# Altium project RaspberryPi_ComputeModule3.PrjPCB (part 1 of 2)
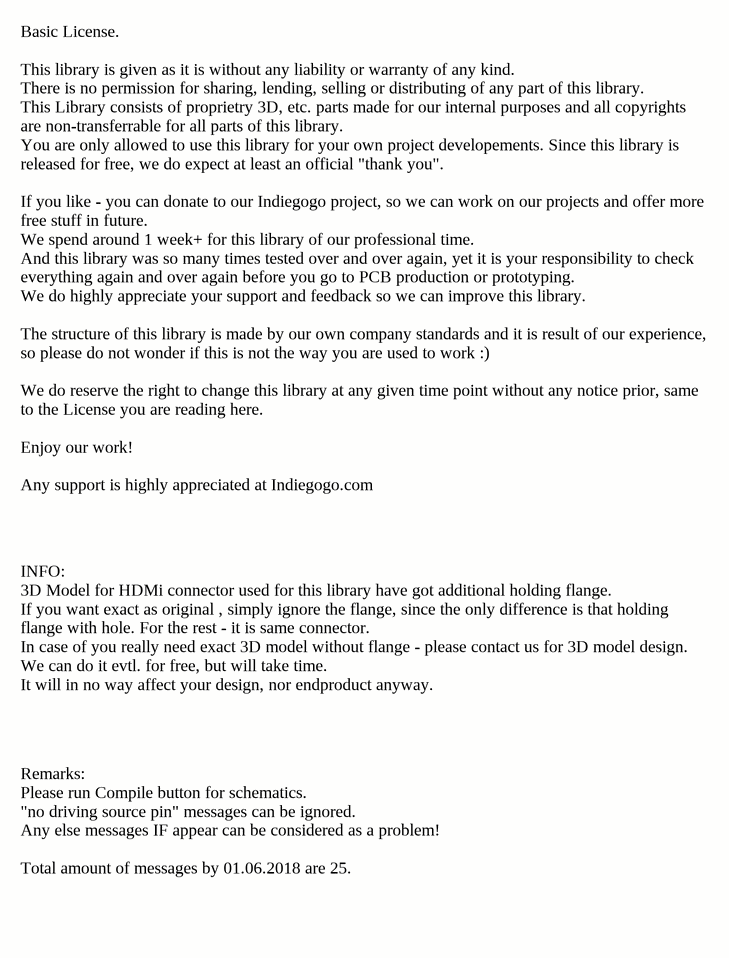
[diagram p0: ReadMe_License.SchDoc]
10 sheets, 86 parts. Net scope: global (net labels, ports and power ports of the same name join across sheets).
Board file: RaspberryPi_ComputeModule3.PcbDoc
Sheets:
  ReadMe_License.SchDoc
  RP_ComputeModule3_rev.3.0_GPIOs.SchDoc
  RP_ComputeModule3_rev.3.0_POWER.SchDoc
  RP_ComputeModule3_rev.3.0_uSDCard.SchDoc
  RP_ComputeModule3_rev.3.0_Headers.SchDoc
  RP_ComputeModule3_rev.3.0_BootSelector.SchDoc
  RP_ComputeModule3_rev.3.0_Displays.SchDoc
  RP_ComputeModule3_rev.3.0_Mechanics.SchDoc
  RP_ComputeModule3_rev.3.0_USB.SchDoc
  RP_ComputeModule3_rev.3.0_HDMi.SchDoc

## Sheet ReadMe_License.SchDoc
size E

### Notes on the sheet
- Basic License.
  This library is given as it is without any liability or warranty of any kind.
  There is no permission for sharing, lending, selling or distributing of any part of this library.
  This Library consists of proprietry 3D, etc. parts made for our internal purposes and all copyrights are non-transferrable for all parts of this library.
  You are only allowed to use this library for your own project developements. Since this library is released for free, we do expect at least an official "thank you".
  If you like - you can donate to our Indiegogo project, so we can work on our projects and offer more free stuff in future.
  We spend around 1 week+ for this library of our professional time.
  And this library was so many times tested over and over again, yet it is your responsibility to check everything again and over again before you go to PCB production or prototyping.
  We do highly appreciate your support and feedback so we can improve this library.
  The structure of this library is made by our own company standards and it is result of our experience, so please do not wonder if this is not the way you are used to work :)
  We do reserve the right to change this library at any given time point without any notice prior, same to the License you are reading here.
  Enjoy our work!
  Any support is highly appreciated at Indiegogo.com
- INFO:
  3D Model for HDMi connector used for this library have got additional holding flange.
  If you want exact as original , simply ignore the flange, since the only difference is that holding flange with hole. For the rest - it is same connector.
  In case of you really need exact 3D model without flange - please contact us for 3D model design.
  We can do it evtl. for free, but will take time.
  It will in no way affect your design, nor endproduct anyway.
- Remarks:
  Please run Compile button for schematics.
  "no driving source pin" messages can be ignored.
  Any else messages IF appear can be considered as a problem!
  Total amount of messages by 01.06.2018 are 25.

## Sheet RP_ComputeModule3_rev.3.0_GPIOs.SchDoc
size A4
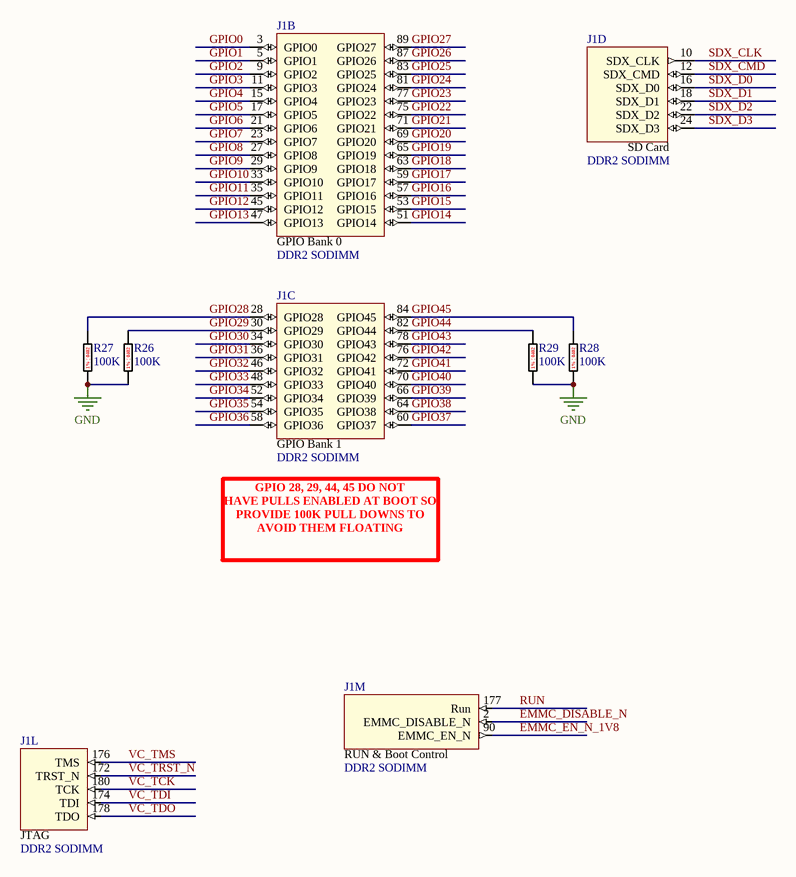
[diagram p1: RP_ComputeModule3_rev.3.0_GPIOs.SchDoc]

### Parts
J1  DDR2 SODIMM  [TE 1473005-4 (DDR2 SO-DIMM)]  (parts B,C,D,L,M of 14)
R26  100K  [RES0402]
R27  100K  [RES0402]
R28  100K  [RES0402]
R29  100K  [RES0402]

### Nets
GND: R26.2 R27.2 R28.2 R29.2
EMMC_DISABLE_N: J1.2(EMMC_DISABLE_N)
EMMC_EN_N_1V8: J1.90(EMMC_EN_N)
GPIO0: J1.3(GPIO0)
GPIO1: J1.5(GPIO1)
GPIO2: J1.9(GPIO2)
GPIO3: J1.11(GPIO3)
GPIO4: J1.15(GPIO4)
GPIO5: J1.17(GPIO5)
GPIO6: J1.21(GPIO6)
GPIO7: J1.23(GPIO7)
GPIO8: J1.27(GPIO8)
GPIO9: J1.29(GPIO9)
GPIO10: J1.33(GPIO10)
GPIO11: J1.35(GPIO11)
GPIO12: J1.45(GPIO12)
GPIO13: J1.47(GPIO13)
GPIO14: J1.51(GPIO14)
GPIO15: J1.53(GPIO15)
GPIO16: J1.57(GPIO16)
GPIO17: J1.59(GPIO17)
GPIO18: J1.63(GPIO18)
GPIO19: J1.65(GPIO19)
GPIO20: J1.69(GPIO20)
GPIO21: J1.71(GPIO21)
GPIO22: J1.75(GPIO22)
GPIO23: J1.77(GPIO23)
GPIO24: J1.81(GPIO24)
GPIO25: J1.83(GPIO25)
GPIO26: J1.87(GPIO26)
GPIO27: J1.89(GPIO27)
GPIO28: J1.28(GPIO28) R27.1
GPIO29: J1.30(GPIO29) R26.1
GPIO30: J1.34(GPIO30)
GPIO31: J1.36(GPIO31)
GPIO32: J1.46(GPIO32)
GPIO33: J1.48(GPIO33)
GPIO34: J1.52(GPIO34)
GPIO35: J1.54(GPIO35)
GPIO36: J1.58(GPIO36)
GPIO37: J1.60(GPIO37)
GPIO38: J1.64(GPIO38)
GPIO39: J1.66(GPIO39)
GPIO40: J1.70(GPIO40)
GPIO41: J1.72(GPIO41)
GPIO42: J1.76(GPIO42)
GPIO43: J1.78(GPIO43)
GPIO44: J1.82(GPIO44) R29.1
GPIO45: J1.84(GPIO45) R28.1
RUN: J1.177(Run)
SDX_CLK: J1.10(SDX_CLK)
SDX_CMD: J1.12(SDX_CMD)
SDX_D0: J1.16(SDX_D0)
SDX_D1: J1.18(SDX_D1)
SDX_D2: J1.22(SDX_D2)
SDX_D3: J1.24(SDX_D3)
VC_TCK: J1.180(TCK)
VC_TDI: J1.174(TDI)
VC_TDO: J1.178(TDO)
VC_TMS: J1.176(TMS)
VC_TRST_N: J1.172(TRST_N)

### Notes on the sheet
- GPIO 28, 29, 44, 45 DO NOT
  HAVE PULLS ENABLED AT BOOT SO PROVIDE 100K PULL DOWNS TO AVOID THEM FLOATING
- (in symbol 1473005-4, part B) GPIO Bank 0
- (in symbol 1473005-4, part C) GPIO Bank 1
- (in symbol 1473005-4, part D) SD Card
- (in symbol 1473005-4, part L) JTAG
- (in symbol 1473005-4, part M) RUN & Boot Control
- (in symbol SG73P1ETTP1003F) 1% | 0402

### Library data of the parts
J1 = 1473005-4: TE CONNECTIVITY / AMP         1473005-4             SOCKET IC, DIMM, DDR2, 1.8V, 200WAY; Number of Contacts: 200; Memory Type: SDRAM,DDR; Insulation Resistance: 250MR; PCB Mount Retention: With; Gender: Female; Contact Current Rating: 500mA; Circuit Application: Power; Connector System: Cable-to-Board; Sealable: No (Without); Pitch: 0.6mm; Row Spacing: 0.244inch; Stack Height: 5.2mm; Supplier 1: Digi-Key; Manufacturer: TE Connectivity; Manufacturer Part Number: 1473005-4; Stock 1: 3804; Pricing 1: 1=3.9, 10=3.744, 25=3.432, 50=3.276, 100=3.12, 250=2.73, 500=2.652, 1000=2.262, 2500=2.106 (USD); Mount: Surface Mount; Number of Pins: 200; Contact Material: Copper Alloy; Contact Plating: Gold; Housing Colour: Black; Housing Material: Thermoplastic; Insulation Material: Thermoplastic; Min Operating Temperature: -67°C; Max Operating Temperature: 185°C; Number of Rows: 2; Orientation: Right Angle; Termination: Solder; Packaging: Tray; Package Quantity: 20; Number of Positions: 200; Voltage Rating: 1.8V; Connector Type: Socket; Length: 71.5mm; Depth: 26mm; Radiation Hardening: No; ELV: Compliant; Flammability Rating: UL94 V-0; Lead Free: Lead Free; REACH SVHC: No SVHC; ComponentLink1URL: https://datasheet.ciiva.com/682/eng-cd-1473005-j2-682720.pdf; ComponentLink1Description: https://datasheet.ciiva.com/682/eng-cd-1473005-j2-682720.pdf; ComponentLink2URL: https://datasheet.ciiva.com/15171/getdatasheetpartid-99150-15171488.pdf; ComponentLink2Description: https://datasheet.ciiva.com/15171/getdatasheetpartid-99150-15171488.pdf; ComponentLink3URL: https://datasheet.ciiva.com/1105/582309-1105221.pdf; ComponentLink3Description: https://datasheet.ciiva.com/1105/582309-1105221.pdf; ComponentLink4URL: https://datasheet.ciiva.com/682/eng-cd-1473005-j2-682726.pdf; ComponentLink4Description: https://datasheet.ciiva.com/682/eng-cd-1473005-j2-682726.pdf; ComponentLink5URL: https://datasheet.ciiva.com/14156/04821302-14156311.pdf; ComponentLink5Description: https://datasheet.ciiva.com/14156/04821302-14156311.pdf; ComponentLink6URL: https://datasheet.ciiva.com/3136/eng-cd-1473005-j-3136060.pdf; ComponentLink6Description: https://datasheet.ciiva.com/3136/eng-cd-1473005-j-3136060.pdf; ComponentLink7URL: https://datasheet.ciiva.com/16380/eng-cd-1473005-j-16380909.pdf; ComponentLink7Description: https://datasheet.ciiva.com/16380/eng-cd-1473005-j-16380909.pdf; ComponentLink8URL: https://datasheet.ciiva.com/16651/eng-cd-1473005-j-16651646.pdf; ComponentLink8Description: https://datasheet.ciiva.com/16651/eng-cd-1473005-j-16651646.pdf
R26-R29 = SG73P1ETTP1003F: Thick Film Resistors - SMD 0.125W 100Kohm 1% 200ppm; Manufacturer: KOA Speer; Resistance: 100kR; Power Rating: 125mW; Voltage Rating: 200V; Temperature Coefficient: 200ppm/°C; Voltage Rating (DC): 50V; Supplier 1: Mouser; Manufacturer Part Number: SG73P1ETTP1003F; Stock 1: 17094; Pricing 1: 1=0.24, 10=0.24, 50=0.053, 100=0.041, 1000=0.03, 10000=0.018 (USD); Case/Package: 0402; Case Code (Imperial): 0402; Case Code (Metric): 1005; Min Operating Temperature: -55°C; Max Operating Temperature: 155°C; Tolerance: 1%; Packaging: Tape and Reel; Termination: SMD/SMT; ComponentLink1URL: https://datasheet.ciiva.com/5567/sg73-5567782.pdf; ComponentLink1Description: https://datasheet.ciiva.com/5567/sg73-5567782.pdf

## Sheet RP_ComputeModule3_rev.3.0_POWER.SchDoc
size A4 portrait
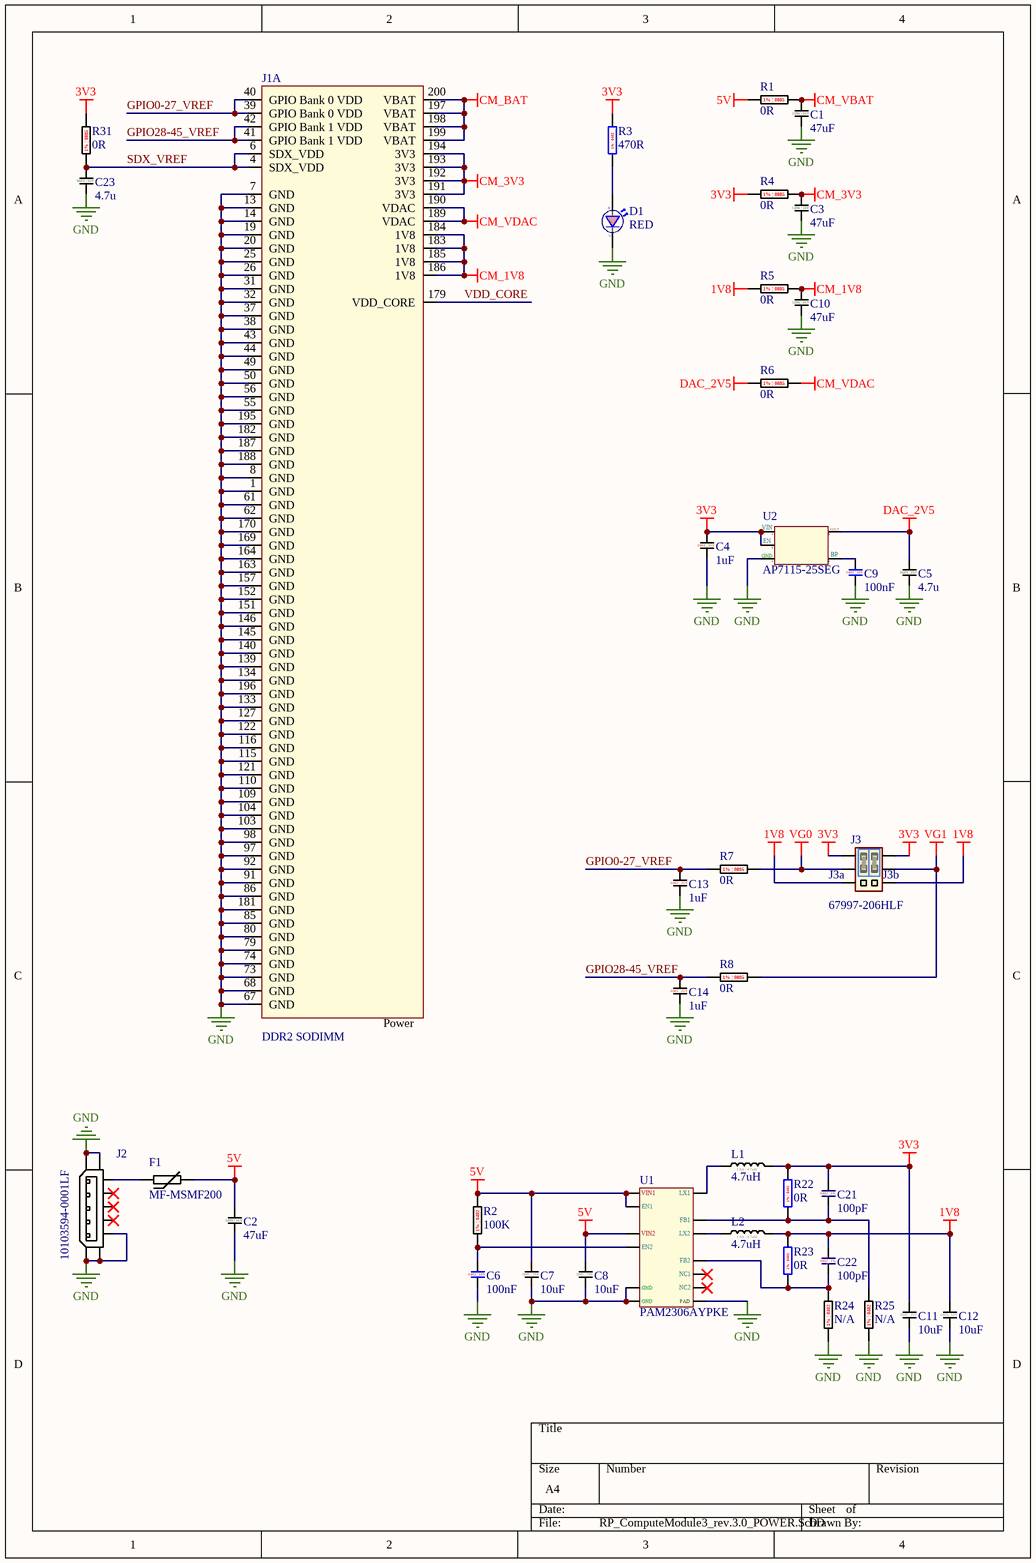
[diagram p2: RP_ComputeModule3_rev.3.0_POWER.SchDoc]

### Parts
C1  47uF  [MURATA C1206 / CAPC3216X94N]
C2  47uF  [MURATA C1206 / CAPC3216X94N]
C3  47uF  [MURATA C1206 / CAPC3216X94N]
C4  1uF  [TDK 0402 C]
C5  4.7u  [0603 Murata]
C6  100nF  [GJM 0402 C]
C7  10uF  [0805 CGA Series]
C8  10uF  [0805 CGA Series]
C9  100nF  [GJM 0402 C]
C10  47uF  [MURATA C1206 / CAPC3216X94N]
C11  10uF  [0805 CGA Series]
C12  10uF  [0805 CGA Series]
C13  1uF  [TDK 0402 C]
C14  1uF  [TDK 0402 C]
C21  100pF  [Cap0402 MIN Vishay N/A]  (no BOM)
C22  100pF  [Cap0402 MIN Vishay N/A]  (no BOM)
C23  4.7u  [0603 Murata]
D1  RED  [ROHM 0603 LED]
F1  MF-MSMF200  [Bourns MF-MSMF (Style1)]
J1  DDR2 SODIMM  [TE 1473005-4 (DDR2 SO-DIMM)]  (part A of 14)
J2  10103594-0001LF  [FCI_10103594-0001LF]
J3  67997-206HLF  [Amphenol 2x6 PINS 67997-206HLF]
J3a  Jumper  [Kobiconn 151-8011-E (Blue)]  (value not drawn)
J3b  Jumper  [Kobiconn 151-8011-E (Blue)]  (value not drawn)
L1  4.7uH  [Bourns SRN4018]
L2  4.7uH  [Bourns SRN4018]
R1  0R  [YAGEO RES0402]
R2  100K  [RES0402]
R3  470R  [Vishay RES0402]
R4  0R  [YAGEO RES0402]
R5  0R  [YAGEO RES0402]
R6  0R  [YAGEO RES0402]
R7  0R  [YAGEO RES0402]
R8  0R  [YAGEO RES0402]
R22  0R  [Vishay Beyschlag MCS0402]
R23  0R  [Vishay Beyschlag MCS0402]
R24  N/A  [RES0402N/A]  (no BOM)
R25  N/A  [RES0402N/A]  (no BOM)
R31  0R  [YAGEO RES0402]
U1  PAM2306AYPKE  [DIODES_SON45P300X300X80-13N]
U2  AP7115-25SEG  [Diodes_SOT353_SC70-5_SOT65P210X110-5N]

### Nets
1V8: C12.1 C22.2 J3.5 J3.6 L2.2 R5.2 R23.1
3V3: C4.1 C11.1 C21.2 J3.1 J3.2 L1.2 R3.1 R4.2 R22.1 R31.1 U2.1 U2.3
5V: C2.2 C7.1 C8.1 F1.2 R1.2 R2.1 U1.1 U1.6 U1.7
CM_1V8: C10.2 J1.183(1V8) J1.184(1V8) J1.185(1V8) J1.186(1V8) R5.1
CM_3V3: C3.2 J1.191(3V3) J1.192(3V3) J1.193(3V3) J1.194(3V3) R4.1
CM_BAT: J1.197(VBAT) J1.198(VBAT) J1.199(VBAT) J1.200(VBAT)
CM_VBAT: C1.2 R1.1
CM_VDAC: J1.189(VDAC) J1.190(VDAC) R6.1
DAC_2V5: C5.2 R6.2 U2.5
GND: C1.1 C2.1 C3.1 C4.2 C5.1 C6.1 C7.2 C8.2 C9.1 C10.1 C11.2 C12.2 C13.2 C14.2 C23.1 D1.C J1.1(GND) J1.7(GND) J1.8(GND) J1.13(GND) J1.14(GND) J1.19(GND) J1.20(GND) J1.25(GND) J1.26(GND) J1.31(GND) J1.32(GND) J1.37(GND) J1.38(GND) J1.43(GND) J1.44(GND) J1.49(GND) J1.50(GND) J1.55(GND) J1.56(GND) J1.61(GND) J1.62(GND) J1.67(GND) J1.68(GND) J1.73(GND) J1.74(GND) J1.79(GND) J1.80(GND) J1.85(GND) J1.86(GND) J1.91(GND) J1.92(GND) J1.97(GND) J1.98(GND) J1.103(GND) J1.104(GND) J1.109(GND) J1.110(GND) J1.115(GND) J1.116(GND) J1.121(GND) J1.122(GND) J1.127(GND) J1.133(GND) J1.134(GND) J1.139(GND) J1.140(GND) J1.145(GND) J1.146(GND) J1.151(GND) J1.152(GND) J1.157(GND) J1.163(GND) J1.164(GND) J1.169(GND) J1.170(GND) J1.181(GND) J1.182(GND) J1.187(GND) J1.188(GND) J1.195(GND) J1.196(GND) J2.5 J2.6 J2.7 J2.8 J2.9 J2.10 J2.11 R24.2 R25.2 U1.3 U1.9 U1.13 U2.2
VG0: J3.3 R7.1
VG1: J3.4 R8.1
GPIO0-27_VREF: C13.1 J1.39(GPIO_Bank_0_VDD) J1.40(GPIO_Bank_0_VDD) R7.2
GPIO28-45_VREF: C14.1 J1.41(GPIO_Bank_1_VDD) J1.42(GPIO_Bank_1_VDD) R8.2
SDX_VREF: C23.2 J1.4(SDX_VDD) J1.6(SDX_VDD) R31.2
VDD_CORE: J1.179(VDD_CORE)
NetC6_2: C6.2 R2.2 U1.12
NetC9_2: C9.2 U2.4
NetC21_1: C21.1 R22.2 R25.1 U1.4
NetC22_1: C22.1 R23.2 R24.1 U1.10
NetD1_A: D1.A R3.2
NetF1_1: F1.1 J2.1
NetL1_1: L1.1 U1.8
NetL2_1: L2.1 U1.2

Not connected (* = marked no-connect by the designer): J2 2* 3* 4*; U1 5* 11*

### Notes on the sheet
- (in symbol AC0805FR-070RL) 1% | 0805
- (in symbol AP7115-25SEG-7) VIN; VOUT; EN; BP; GND
- (in symbol C1005X5R1E105K050BC) 0402 | 25V
- (in symbol C2012X7S1C106K125AC) 0805 | 16V
- (in symbol C3216JB1C476M160AB) 1206 | 16V
- (in symbol GRM155R71A104JA01D) 0402 | 10V
- (in symbol GRT188R6YA475KE13D) 0603 | 35V
- (in symbol MCS04020C4700FE000) 1% | 0402
- (in symbol MCS04020Z0000ZE000) 1% | 0402
- (in symbol PAM2306AYPKE) VIN1; LX1; EN1; FB1; VIN2; LX2; EN2; FB2; NC1; GND; NC2; PAD
- (in symbol Resistor_N/A) 1% | 0402
- (in symbol SG73P1ETTP1003F) 1% | 0402
- (in symbol SRN4018-4R7M) 1.9A / 4.7uH
- (in symbol VJ0402A101FXACW1BC_NA) 0402 | 1%

### Library data of the parts
C1-C3 C10 = C3216JB1C476M160AB: 47µF ±20% 16V JB Ceramic Capacitor -25°C ~ 85°C Surface Mount, MLCC 1206 (3216 Metric) 0.126" L x 0.063" W (3.20mm x 1.60mm); Manufacturer: TDK; Supplier 1: Digi-Key; Manufacturer Part Number: C3216JB1C476M160AB; Stock 1: 203837; Pricing 1: 1=1.2, 10=0.949, 100=0.7116, 500=0.53762, 1000=0.47438 (USD); Mount: Surface Mount; Case/Package: 1206; Case Code (Metric): 3216; Case Code (Imperial): 1206; Dielectric Material: Ceramic; Min Operating Temperature: -25°C; Max Operating Temperature: 85°C; Package Quantity: 1; Packaging: Tape and Reel; Capacitance: 47uF; Tolerance: 20%; Voltage Rating: 16V; Termination: SMD/SMT; Composition: Ceramic; Voltage Rating (DC): 16V; Length: 0.126inch; Height: 1.6mm; Width: 0.063inch; Thickness: 0.069inch; Lead Free: Lead Free; ComponentLink1URL: https://product.tdk.com/en/products/common/pdf/mlcc_partnumber_description.pdf; ComponentLink1Description: https://product.tdk.com/en/products/common/pdf/mlcc_partnumber_description.pdf; ComponentLink2URL: http://product.tdk.com/en/catalog/datasheets/mlcc_commercial_general_en.pdf; ComponentLink2Description: http://product.tdk.com/en/catalog/datasheets/mlcc_commercial_general_en.pdf; ComponentLink3URL: http://www.mouser.com/ds/2/400/lcc_commercial_general_en-837201.pdf; ComponentLink3Description: http://www.mouser.com/ds/2/400/lcc_commercial_general_en-837201.pdf
C4 C13 C14 = C1005X5R1E105K050BC: Multilayer Ceramic Capacitors MLCC - SMD/SMT 0402 25V 1uF X5R 10% T: 0.5mm; Manufacturer: TDK; Type: Multilayer Ceramic Chip Capacitor; Voltage Rating DC: 25 VDC; Capacitance - nF: 1000 nF; Product Status: Not Recommended for New Designs; Supplier 1: Mouser; Manufacturer Part Number: C1005X5R1E105K050BC; RoHS: RoHS Compliant; Category: Multilayer Ceramic Capacitors MLCC - SMD/SMT; Stock 1: 6906; Pricing 1: 1=0.201, 10=0.136, 100=0.054, 500=0.045, 1000=0.037, 2500=0.031, 10000=0.027 (USD); Capacitance: 1 uF; Height: 0.5 mm; Length: 1 mm; Package / Case: 0402 (1005 metric); Packaging: Cut Tape; Product: General Type MLCCs; Series: C; Termination Style: SMD/SMT; Tolerance: 10 %; Width: 0.5 mm; Brand: TDK; Case Code - in: 0402; Case Code - mm: 1005; Dielectric: X5R; Maximum Operating Temperature: + 85 C; Minimum Operating Temperature: - 55 C; Standard Pack Qty: 10000; RoHS - Mouser: Y; Minimum Order Quantity: 1; Reeling: True; ComponentLink1URL: https://www.mouser.com/ds/2/400/lcc_commercial_general_en-837201.pdf; ComponentLink1Description: https://www.mouser.com/ds/2/400/lcc_commercial_general_en-837201.pdf
C5 C23 = GRT188R6YA475KE13D: 4.7µF 35V Ceramic Capacitor X5R 0603 (1608 Metric) 0.063" L x 0.031" W (1.60mm x 0.80mm); Manufacturer: Murata; Capacitance: 4.7uF; Tolerance: 10%; Supplier 1: Mouser; Manufacturer Part Number: GRT188R6YA475KE13D; Stock 1: 292; Pricing 1: 10000=0.133 (USD); Mount: Surface Mount; Case/Package: 0603; Case Code (Metric): 1608; Case Code (Imperial): 0603; Min Operating Temperature: -55°C; Max Operating Temperature: 85°C; Packaging: Tape and Reel; Voltage Rating: 35V; Length: 0.063inch; Width: 0.031inch; Thickness: 0.035inch; ComponentLink1URL: http://search.murata.co.jp/Ceramy/image/img/A01X/G101/ENG/GRT188R6YA475KE13-01.pdf; ComponentLink1Description: http://search.murata.co.jp/Ceramy/image/img/A01X/G101/ENG/GRT188R6YA475KE13-01.pdf
C6 C9 = GRM155R71A104JA01D: Multilayer Ceramic Capacitors MLCC - SMD/SMT 0402 0.1uF 10volts 5%; Manufacturer: Murata Electronics; Type: Chip Monolithic Ceramic Capacitor; Voltage Rating DC: 10 VDC; Capacitance - pF: 100000 pF; Dielectric: X7R; Supplier 1: Mouser; Manufacturer Part Number: GRM155R71A104JA01D; RoHS: RoHS Compliant; Category: Multilayer Ceramic Capacitors MLCC - SMD/SMT; Stock 1: 376; Pricing 1: 1=0.100, 10=0.024, 100=0.011, 500=0.008, 1000=0.006, 5000=0.005, 10000=0.004 (USD); Capacitance: 0.1 uF; Height: 0.5 mm; Length: 1 mm; Package / Case: 0402 (1005 metric); Packaging: Cut Tape; Product: General Type MLCCs; Series: GRM; Termination Style: SMD/SMT; Tolerance: 5 %; Width: 0.5 mm; Brand: Murata Electronics; Capacitance - nF: 100 nF; Case Code - in: 0402; Case Code - mm: 1005; Maximum Operating Temperature: + 125 C; Minimum Operating Temperature: - 55 C; Standard Pack Qty: 10000; RoHS - Mouser: Y; Minimum Order Quantity: 1; Reeling: True; ComponentLink1URL: https://www.mouser.com/ds/2/281/c02e-2905.pdf; ComponentLink1Description: https://www.mouser.com/ds/2/281/c02e-2905.pdf
C7 C8 C11 C12 = C2012X7S1C106K125AC: Manufacturer: TDK; Supplier 1: Mouser; Manufacturer Part Number: C2012X7S1C106K125AC; Stock 1: 5410; Pricing 1: 1=0.7, 10=0.4, 50=0.4, 100=0.27, 1000=0.226, 10000=0.138 (USD)
C21 C22 = VJ0402A101FXACW1BC_NA: Multilayer Ceramic Capacitors MLCC - SMD/SMT 0402 100pF 50volts C0G 1%; Manufacturer: Vishay Vitramon; Dielectric Material: Tantalum; Voltage Rating (DC): 50V; Supplier 1: Mouser; Manufacturer Part Number: VJ0402A101FXACW1BC; Stock 1: 4478; Pricing 1: 10000=0.026 (USD); Mount: Surface Mount; Case/Package: 0402; Case Code (Imperial): 0402; Case Code (Metric): 1005; Min Operating Temperature: -55°C; Max Operating Temperature: 125°C; Capacitance: 100pF; Tolerance: 1%; Packaging: Tape and Reel; Package Quantity: 10000; Dielectric: C0G; Termination: SMD/SMT; Length: 1mm; Height: 0.55mm; Width: 0.5mm; Depth: 0.5mm; Lead Free: Lead Free; ComponentLink1URL: https://datasheet.ciiva.com/11477/vjw1bcbascomseries-11477228.pdf; ComponentLink1Description: https://datasheet.ciiva.com/11477/vjw1bcbascomseries-11477228.pdf
D1 = SML-D12U8WT86: LED RED DIFFUSED 0603 SMD; Manufacturer: Rohm; Lens Colour: White,Clear,Diffused; Lens Style: Diffused,Colorless,Rectangular; Forward Voltage: 2.2V; Forward Current: 20mA; Luminous Intensity: 63mcd; Dominant Wavelength: 620nm; Number of LEDs: 1; Viewing Angle: 160°; Supplier 1: Mouser; Manufacturer Part Number: SML-D12U8WT86; Stock 1: 16573; Pricing 1: 1=0.32, 10=0.216, 50=0.216, 100=0.09, 1000=0.062, 10000=0.041 (USD); Mount: Surface Mount; Case/Package: 0603; Number of Pins: 2; Colour: Red; Case Code (Metric): 1608; Case Code (Imperial): 0603; Min Operating Temperature: -40°C; Max Operating Temperature: 85°C; Packaging: Tape and Reel; Wavelength: 620nm; Package Quantity: 1; Illumination Colour: Red; Test Current: 20mA; Lens Transparency: Diffused; Length: 1.6mm; Height: 0.65mm; Width: 0.8mm; Radiation Hardening: No; REACH SVHC: No SVHC; Lead Free: Lead Free; ComponentLink1URL: https://datasheet.ciiva.com/11774/0900766b80df3ada-11774020.pdf; ComponentLink1Description: https://datasheet.ciiva.com/11774/0900766b80df3ada-11774020.pdf; ComponentLink2URL: https://datasheet.ciiva.com/2110/sml-d1-2110375.pdf; ComponentLink2Description: https://datasheet.ciiva.com/2110/sml-d1-2110375.pdf; ComponentLink3URL: https://datasheet.ciiva.com/2110/sml-d1-2110376.pdf; ComponentLink3Description: https://datasheet.ciiva.com/2110/sml-d1-2110376.pdf; ComponentLink4URL: https://datasheet.ciiva.com/2110/sml-d1-2110377.pdf; ComponentLink4Description: https://datasheet.ciiva.com/2110/sml-d1-2110377.pdf; ComponentLink5URL: https://datasheet.ciiva.com/9324/sml-d1-9324826.pdf; ComponentLink5Description: https://datasheet.ciiva.com/9324/sml-d1-9324826.pdf; ComponentLink6URL: https://datasheet.ciiva.com/17420/sml-d1-17420939.pdf; ComponentLink6Description: https://datasheet.ciiva.com/17420/sml-d1-17420939.pdf
F1 = MF-MSMF200-2: PTC RESETTABLE 2.00A 8V 1812; Manufacturer: Bourns; Max Current Rating: 40A; Power Dissipation: 800mW; Hold Current: 2A; Trip Current: 4A; Resistance: 80mR; Time to Trip: 3s; Approvals: UL,CSA,TUV; Supplier 1: Mouser; Manufacturer Part Number: MF-MSMF200-2; Stock 1: 5483; Pricing 1: 1=0.38, 10=0.306, 50=0.306, 100=0.255, 1000=0.244, 10000=0.244 (USD); Mount: Surface Mount,PCB; Case/Package: 1812; Case Code (Metric): 4532; Case Code (Imperial): 1812; Number of Terminals: 2; Terminal Material: Nickel; Min Operating Temperature: -40°C; Max Operating Temperature: 85°C; Current Rating: 40A; Package Quantity: 2000; Packaging: Tape and Reel; Operating Supply Voltage: 8V; Voltage Rating: 8V; Termination: SMD/SMT; Max Power Dissipation: 800mW; Voltage Rating (DC): 8V; Length: 4.73mm; Height: 0.85mm; Width: 3.41mm; Radiation Hardening: No; REACH SVHC: No SVHC; Lead Free: Lead Free; ComponentLink1URL: https://datasheet.ciiva.com/1228/1786007-1228163.pdf; ComponentLink1Description: https://datasheet.ciiva.com/1228/1786007-1228163.pdf; ComponentLink2URL: https://datasheet.ciiva.com/3020/mfmsmf-3020419.pdf; ComponentLink2Description: https://datasheet.ciiva.com/3020/mfmsmf-3020419.pdf; ComponentLink3URL: https://datasheet.ciiva.com/326/mfmsmf-326966.pdf; ComponentLink3Description: https://datasheet.ciiva.com/326/mfmsmf-326966.pdf; ComponentLink4URL: https://datasheet.ciiva.com/326/mfmsmf-326967.pdf; ComponentLink4Description: https://datasheet.ciiva.com/326/mfmsmf-326967.pdf; ComponentLink5URL: https://datasheet.ciiva.com/326/mfmsmf-326968.pdf; ComponentLink5Description: https://datasheet.ciiva.com/326/mfmsmf-326968.pdf; ComponentLink6URL: https://datasheet.ciiva.com/16692/mfmsmf-16692201.pdf; ComponentLink6Description: https://datasheet.ciiva.com/16692/mfmsmf-16692201.pdf; ComponentLink7URL: https://datasheet.ciiva.com/3019/mfmsmf-3019786.pdf; ComponentLink7Description: https://datasheet.ciiva.com/3019/mfmsmf-3019786.pdf; ComponentLink8URL: https://datasheet.ciiva.com/28411/1786007-28411578.pdf; ComponentLink8Description: https://datasheet.ciiva.com/28411/1786007-28411578.pdf; ComponentLink9URL: https://datasheet.ciiva.com/1274/1786007-1274556.pdf; ComponentLink9Description: https://datasheet.ciiva.com/1274/1786007-1274556.pdf; ComponentLink10URL: https://datasheet.ciiva.com/15187/getdatasheetpartid-117210-15187148.pdf; ComponentLink10Description: https://datasheet.ciiva.com/15187/getdatasheetpartid-117210-15187148.pdf; ComponentLink11URL: https://datasheet.ciiva.com/1274/1786007-1274557.pdf; ComponentLink11Description: https://datasheet.ciiva.com/1274/1786007-1274557.pdf; ComponentLink12URL: https://datasheet.ciiva.com/30196/575mfmsmf-30196429.pdf; ComponentLink12Description: https://datasheet.ciiva.com/30196/575mfmsmf-30196429.pdf
J1 = 1473005-4: as J1 on sheet RP_ComputeModule3_rev.3.0_GPIOs; Supplier 1: Digi-Key; Manufacturer: TE Connectivity; Manufacturer Part Number: 1473005-4; Stock 1: 3804; Pricing 1: 1=3.9, 10=3.744, 25=3.432, 50=3.276, 100=3.12, 250=2.73, 500=2.652, 1000=2.262, 2500=2.106 (USD); Mount: Surface Mount; Number of Pins: 200; Contact Material: Copper Alloy; Contact Plating: Gold; Housing Colour: Black; Housing Material: Thermoplastic; Insulation Material: Thermoplastic; Min Operating Temperature: -67°C; Max Operating Temperature: 185°C; Number of Rows: 2; Orientation: Right Angle; Termination: Solder; Packaging: Tray; Package Quantity: 20; Number of Positions: 200; Voltage Rating: 1.8V; Connector Type: Socket; Length: 71.5mm; Depth: 26mm; Radiation Hardening: No; ELV: Compliant; Flammability Rating: UL94 V-0; Lead Free: Lead Free; REACH SVHC: No SVHC; ComponentLink1URL: https://datasheet.ciiva.com/682/eng-cd-1473005-j2-682720.pdf; ComponentLink1Description: https://datasheet.ciiva.com/682/eng-cd-1473005-j2-682720.pdf; ComponentLink2URL: https://datasheet.ciiva.com/15171/getdatasheetpartid-99150-15171488.pdf; ComponentLink2Description: https://datasheet.ciiva.com/15171/getdatasheetpartid-99150-15171488.pdf; ComponentLink3URL: https://datasheet.ciiva.com/1105/582309-1105221.pdf; ComponentLink3Description: https://datasheet.ciiva.com/1105/582309-1105221.pdf; ComponentLink4URL: https://datasheet.ciiva.com/682/eng-cd-1473005-j2-682726.pdf; ComponentLink4Description: https://datasheet.ciiva.com/682/eng-cd-1473005-j2-682726.pdf; ComponentLink5URL: https://datasheet.ciiva.com/14156/04821302-14156311.pdf; ComponentLink5Description: https://datasheet.ciiva.com/14156/04821302-14156311.pdf; ComponentLink6URL: https://datasheet.ciiva.com/3136/eng-cd-1473005-j-3136060.pdf; ComponentLink6Description: https://datasheet.ciiva.com/3136/eng-cd-1473005-j-3136060.pdf; ComponentLink7URL: https://datasheet.ciiva.com/16380/eng-cd-1473005-j-16380909.pdf; ComponentLink7Description: https://datasheet.ciiva.com/16380/eng-cd-1473005-j-16380909.pdf; ComponentLink8URL: https://datasheet.ciiva.com/16651/eng-cd-1473005-j-16651646.pdf; ComponentLink8Description: https://datasheet.ciiva.com/16651/eng-cd-1473005-j-16651646.pdf
J2 = 10103594-0001LF: USB - micro B USB 2.0 Receptacle Connector 5 Position Surface Mount, Right Angle, Horizontal; Manufacturer: Amphenol FCI; Voltage Rating: 100V; Current Rating: 1.8A; Connector Type: USB,Receptacle; Number of Ports: 1; Insulation Resistance: 1GR; Number of Contacts: 5; USB Standard: USB 2.0; Pitch: 0.65mm; Supplier 1: Mouser; Manufacturer Part Number: 10103594-0001LF; Stock 1: 28662; Pricing 1: 1=0.7, 10=0.522, 50=0.522, 100=0.501, 1000=0.359, 10000=0.294 (USD); Mount: Surface Mount,Horizontal; Contact Plating: Nickel,Gold; Contact Material: Copper,Copper Alloy; Number of Terminals: 5; Housing Material: Thermoplastic; Min Operating Temperature: -55°C; Max Operating Temperature: 85°C; Termination: Solder; Orientation: Right Angle; Gender: Receptacle; Packaging: Tape and Reel; Package Quantity: 1500; Max Voltage Rating (AC): 100V; Length: 8.04mm; Radiation Hardening: No; REACH SVHC: No SVHC; Lead Free: Lead Free; ComponentLink1URL: https://datasheet.ciiva.com/8015/10103594-8015248.pdf; ComponentLink1Description: https://datasheet.ciiva.com/8015/10103594-8015248.pdf; ComponentLink2URL: https://datasheet.ciiva.com/11731/0900766b80ed1ae4-11731328.pdf; ComponentLink2Description: https://datasheet.ciiva.com/11731/0900766b80ed1ae4-11731328.pdf; ComponentLink3URL: https://datasheet.ciiva.com/14618/70236822-14618885.pdf; ComponentLink3Description: https://datasheet.ciiva.com/14618/70236822-14618885.pdf; ComponentLink4URL: https://datasheet.ciiva.com/22654/1469075-22654519.pdf; ComponentLink4Description: https://datasheet.ciiva.com/22654/1469075-22654519.pdf; ComponentLink5URL: https://datasheet.ciiva.com/851/10103594-851115.pdf; ComponentLink5Description: https://datasheet.ciiva.com/851/10103594-851115.pdf; ComponentLink6URL: https://datasheet.ciiva.com/5726/10103594-5726971.pdf; ComponentLink6Description: https://datasheet.ciiva.com/5726/10103594-5726971.pdf; ComponentLink7URL: https://datasheet.ciiva.com/851/10103594-851116.pdf; ComponentLink7Description: https://datasheet.ciiva.com/851/10103594-851116.pdf; ComponentLink8URL: https://datasheet.ciiva.com/851/10103594-851117.pdf; ComponentLink8Description: https://datasheet.ciiva.com/851/10103594-851117.pdf
J3 = 67997-206HLF: 6 Positions Header, Unshrouded Connector 0.100" (2.54mm) Through Hole Gold or Gold, GXT™; Manufacturer: Amphenol FCI; Current Rating: 3A; Voltage Rating: 1.5kV; Number of Positions: 6; Insulation Resistance: 5GR; Gender: Male; Connector Type: Male Pin; Mating Post Length: 5.84mm; Row Spacing: 0.1inch; Supplier 1: Mouser; Manufacturer Part Number: 67997-206HLF; Stock 1: 2377; Pricing 1: 1=0.33, 10=0.223, 50=0.223, 100=0.215, 1000=0.154, 10000=0.123 (USD); Mount: Through Hole; Contact Plating: Nickel,Gold,GXT; Contact Material: Bronze; Colour: Black; Housing Colour: Black; Housing Material: Thermoplastic; Min Operating Temperature: -65°C; Max Operating Temperature: 125°C; Number of Rows: 2; Contact Gender: Male; Packaging: Bulk; Package Quantity: 100; Termination: Solder; Max Voltage Rating (AC): 1.5kV; Number of Contacts: 6; Orientation: Straight; Length: 7.62mm; Pitch: 2.54mm; Termination Post Length: 3.05mm; Contact Mating Length: 0.23inch; Depth: 4.83mm; Radiation Hardening: No; Flammability Rating: UL94 V-0; ComponentLink1URL: https://datasheet.ciiva.com/5150/67996-223474-5150000.pdf; ComponentLink1Description: https://datasheet.ciiva.com/5150/67996-223474-5150000.pdf; ComponentLink2URL: https://datasheet.ciiva.com/9474/67996-9474266.pdf; ComponentLink2Description: https://datasheet.ciiva.com/9474/67996-9474266.pdf; ComponentLink3URL: https://datasheet.ciiva.com/728/67996-728908.pdf; ComponentLink3Description: https://datasheet.ciiva.com/728/67996-728908.pdf
J3a J3b = 151-8011-E: Headers & Wire Housings MINI JUMPER GF 6.0MM CLOSE TYPE BLUE; Manufacturer: Kobiconn; Number of Positions: 2; Pitch: 2.54mm; Supplier 1: Mouser; Manufacturer Part Number: 151-8011-E; Stock 1: 0; Contact Gender: Male; Package Quantity: 2000; ComponentLink1URL: https://datasheet.ciiva.com/5162/kc-301174-5162989.pdf; ComponentLink1Description: https://datasheet.ciiva.com/5162/kc-301174-5162989.pdf
L1 L2 = SRN4018-4R7M: FIXED IND 4.7UH 1.9A 84 MOHM SMD; Manufacturer: Bourns; Core Material: Ferrite; Material: Steel; Saturation Current: 2A; Tolerance: 20%; Shielding: Shielded; DC Resistance (DCR): 84mR; Self Resonant Frequency: 35MHz; Test Frequency: 100kHz; Supplier 1: Mouser; Manufacturer Part Number: SRN4018-4R7M; Stock 1: 1984; Pricing 1: 1=0.36, 10=0.246, 50=0.246, 100=0.224, 1000=0.152, 10000=0.131 (USD); Mount: Surface Mount; Case/Package: Nonstandard; Number of Pins: 2; Min Operating Temperature: -25°C; Max Operating Temperature: 120°C; Packaging: Cut Tape; Package Quantity: 3000; Current Rating: 1.9A; Inductance: 4.7uh; Inductance Tolerance: 20%; Composition: Wirewound; Max DC Current: 1.9A; Termination: SMD/SMT; RMS Current (Irms): 1.9A; DC Current: 1.9A; Military Standard: Not; Length: 4mm; Height: 1.8mm; Width: 4mm; Height - Seated (Max): 0.071inch; Depth: 4.2mm; Radiation Hardening: No; REACH SVHC: No SVHC; ComponentLink1URL: https://datasheet.ciiva.com/6700/srn4018-6700960.pdf; ComponentLink1Description: https://datasheet.ciiva.com/6700/srn4018-6700960.pdf; ComponentLink2URL: https://datasheet.ciiva.com/22717/1684089-22717774.pdf; ComponentLink2Description: https://datasheet.ciiva.com/22717/1684089-22717774.pdf; ComponentLink3URL: https://datasheet.ciiva.com/46395/1684089-46395167.pdf; ComponentLink3Description: https://datasheet.ciiva.com/46395/1684089-46395167.pdf
R1 R4-R8 R31 = AC0805FR-070RL: Thick Film Resistors - SMD 1/8W 0.0ohm 1%; Manufacturer: Yageo; Voltage Rating: 150V; Power Rating: 125mW; Resistance: 0mR; Temperature Coefficient: 200ppm/°C; Supplier 1: Mouser; Manufacturer Part Number: AC0805FR-070RL; Stock 1: 1027; Pricing 1: 1=0.16, 10=0.036, 50=0.036, 100=0.012, 1000=0.009, 10000=0.004 (USD); Mount: Surface Mount; Case/Package: 0805; Case Code (Imperial): 0805; Case Code (Metric): 2012; Min Operating Temperature: -55°C; Max Operating Temperature: 155°C; Tolerance: 1%; Packaging: Tape and Reel; Termination: SMD/SMT; Lead Free: Lead Free; ComponentLink1URL: https://datasheet.ciiva.com/12656/pyu-ac-51-rohs-l-2-12656890.pdf; ComponentLink1Description: https://datasheet.ciiva.com/12656/pyu-ac-51-rohs-l-2-12656890.pdf
R2 = SG73P1ETTP1003F: as R26 on sheet RP_ComputeModule3_rev.3.0_GPIOs; Supplier 1: Mouser; Manufacturer Part Number: SG73P1ETTP1003F; Stock 1: 17094; Pricing 1: 1=0.24, 10=0.24, 50=0.053, 100=0.041, 1000=0.03, 10000=0.018 (USD); Case/Package: 0402; Case Code (Imperial): 0402; Case Code (Metric): 1005; Min Operating Temperature: -55°C; Max Operating Temperature: 155°C; Tolerance: 1%; Packaging: Tape and Reel; Termination: SMD/SMT; ComponentLink1URL: https://datasheet.ciiva.com/5567/sg73-5567782.pdf; ComponentLink1Description: https://datasheet.ciiva.com/5567/sg73-5567782.pdf
R3 = MCS04020C4700FE000: RES SMD 470 OHM 1% 1/10W 0402; Manufacturer: Vishay BCcomponents; Temperature Coefficient: 50ppm/°C; Max Power Dissipation: 100mW; Supplier 1: Digi-Key; Manufacturer Part Number: MCS04020C4700FE000; Stock 1: 98990; Pricing 1: 1=0.3, 10=0.254, 100=0.0993, 1000=0.04158, 2500=0.03812, 5000=0.03465 (USD); Case/Package: 0402; Contact Plating: Tin; Min Operating Temperature: -55°C; Max Operating Temperature: 125°C; Resistance: 470R; Tolerance: 1%; Composition: Thin Film; Packaging: Tape and Reel; Package Quantity: 10000; Number of Terminations: 2; Military Standard: Not; Length: 0.039inch; Height: 0.015inch; Width: 0.02inch; Depth: 0.5mm; Radiation Hardening: No; Lead Free: Lead Free; ComponentLink1URL: https://datasheet.ciiva.com/16892/mc-pro-16892843.pdf; ComponentLink1Description: https://datasheet.ciiva.com/16892/mc-pro-16892843.pdf; ComponentLink2URL: https://datasheet.ciiva.com/2569/mc-pro-2569740.pdf; ComponentLink2Description: https://datasheet.ciiva.com/2569/mc-pro-2569740.pdf; ComponentLink3URL: https://datasheet.ciiva.com/8901/mc-pro-8901326.pdf; ComponentLink3Description: https://datasheet.ciiva.com/8901/mc-pro-8901326.pdf
R22 R23 = MCS04020Z0000ZE000: Res Thin Film 0402 0 Ohm Molded SMD Automotive Medical Paper T/R; Manufacturer: Vishay Beyschlag; Resistance: 0mR; Power Rating: 100mW; Voltage Rating: 50V; Supplier 1: Digi-Key; Manufacturer Part Number: MCS04020Z0000ZE000; Stock 1: 192140; Pricing 1: 1=0.31, 10=0.266, 25=0.1936, 50=0.1404, 100=0.1041, 250=0.07988, 500=0.06292, 1000=0.04356, 5000=0.0363 (USD); Mount: Surface Mount; Case/Package: 0402; Contact Plating: Nickel,Tin; Case Code (Metric): 1005; Case Code (Imperial): 0402; Min Operating Temperature: -55°C; Max Operating Temperature: 125°C; Composition: Thin Film; Package Quantity: 1; Packaging: Tape and Reel; Number of Terminations: 2; Military Standard: Not; Max Power Dissipation: 100mW; Voltage Rating (DC): 50V; Termination: Wraparound; Length: 1mm; Height: 0.015inch; Width: 0.02inch; Depth: 0.5mm; Radiation Hardening: No; REACH SVHC: No SVHC; Lead Free: Lead Free; ComponentLink1URL: https://datasheet.ciiva.com/2472/mc-pro-2472006.pdf; ComponentLink1Description: https://datasheet.ciiva.com/2472/mc-pro-2472006.pdf; ComponentLink2URL: https://datasheet.ciiva.com/8901/mc-pro-8901830.pdf; ComponentLink2Description: https://datasheet.ciiva.com/8901/mc-pro-8901830.pdf; ComponentLink3URL: https://datasheet.ciiva.com/2472/mc-pro-2472007.pdf; ComponentLink3Description: https://datasheet.ciiva.com/2472/mc-pro-2472007.pdf; ComponentLink4URL: https://datasheet.ciiva.com/2472/mc-pro-2472008.pdf; ComponentLink4Description: https://datasheet.ciiva.com/2472/mc-pro-2472008.pdf
R24 R25 = Resistor_N/A
U1 = PAM2306AYPKE: Conv DC-DC Dual Step Down 2.5V 5.5V 12-Pin WDFN T/R; Manufacturer: Diodes; Number of Outputs: 2; Output Voltage: 3.3V; Max Output Current: 1A; Efficiency: 96%; Switching Frequency: 1.5MHz; Synchronous Rectifier: Yes; Operating Supply Current: 40uA; Supplier 1: Mouser; Manufacturer Part Number: PAM2306AYPKE; Stock 1: 11874; Pricing 1: 1=0.71, 10=0.589, 50=0.589, 100=0.38, 1000=0.304, 10000=0.248 (USD); Mount: Surface Mount; Number of Pins: 12; Min Operating Temperature: -40°C; Max Operating Temperature: 85°C; Packaging: Tape and Reel; Min Input Voltage: 2.5V; Max Input Voltage: 5.5V; Min Output Voltage: 3.3V; Output Current: 1A; Package Quantity: 3000; Min Supply Voltage: 2.5V; Operating Supply Voltage: 5.5V; Radiation Hardening: No; Lead Free: Lead Free; ComponentLink1URL: http://www.diodes.com/datasheets/PAM2306.pdf; ComponentLink1Description: http://www.diodes.com/datasheets/PAM2306.pdf; ComponentLink2URL: http://www.mouser.com/ds/2/115/PAM2306-336770.pdf; ComponentLink2Description: http://www.mouser.com/ds/2/115/PAM2306-336770.pdf; ComponentLink3URL: https://www.diodes.com/assets/Datasheets/PAM2306.pdf; ComponentLink3Description: https://www.diodes.com/assets/Datasheets/PAM2306.pdf
U2 = AP7115-25SEG-7: IC REG LDO 2.5V 0.15A SOT353; Manufacturer: Diodes; Max Power Dissipation: 500mW; Number of Outputs: 1; Max Input Voltage: 5.5V; Max Output Current: 150mA; Quiescent Current: 80uA; Polarity: Positive; Accuracy: 2%; Dropout Voltage: 200mV; Min Current Limit: 200mA; Power Supply Rejection Ratio (PSRR): 70dB; Supplier 1: Mouser; Manufacturer Part Number: AP7115-25SEG-7; Stock 1: 5001; Pricing 1: 1=0.38, 10=0.288, 50=0.288, 100=0.156, 1000=0.117, 10000=0.095 (USD); Mount: Surface Mount; Case/Package: SOT-353-5; Number of Pins: 5; Contact Plating: Tin,Matte; Min Operating Temperature: -40°C; Max Operating Temperature: 85°C; Output Voltage: 2.5V; Packaging: Tape and Reel; Min Input Voltage: 2.5V; Package Quantity: 1; Output Current: 150mA; Number of Regulators: 1; Power Rating: 500mW; Input Bias Current: 80uA; Length: 3mm; Height: 1.1mm; Width: 1.6mm; ComponentLink1URL: https://datasheet.ciiva.com/2039/ap7115-2039392.pdf; ComponentLink1Description: https://datasheet.ciiva.com/2039/ap7115-2039392.pdf; ComponentLink2URL: https://datasheet.ciiva.com/26949/getdatasheetpartid-671041-26949332.pdf; ComponentLink2Description: https://datasheet.ciiva.com/26949/getdatasheetpartid-671041-26949332.pdf; ComponentLink3URL: https://datasheet.ciiva.com/17365/ap7115-17365815.pdf; ComponentLink3Description: https://datasheet.ciiva.com/17365/ap7115-17365815.pdf

## Sheet RP_ComputeModule3_rev.3.0_uSDCard.SchDoc
size A4 portrait
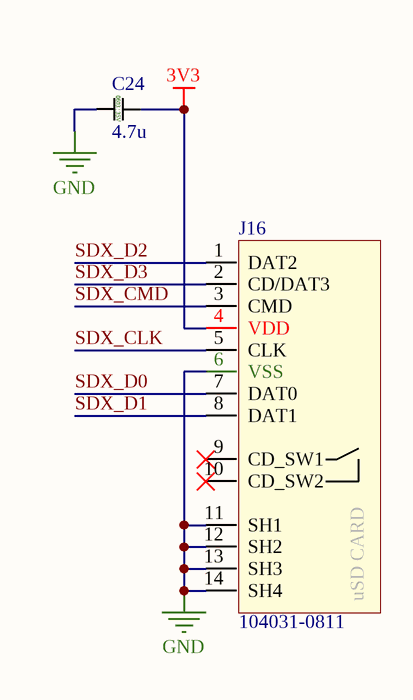
[diagram p3: RP_ComputeModule3_rev.3.0_uSDCard.SchDoc]

### Parts
C24  4.7u  [0603 Murata]
J16  104031-0811  [MOLEX 104031-0811]

### Nets
3V3: C24.2 J16.4(VDD)
GND: C24.1 J16.6(VSS) J16.11(SH1) J16.12(SH2) J16.13(SH3) J16.14(SH4)
SDX_CLK: J16.5(CLK)
SDX_CMD: J16.3(CMD)
SDX_D0: J16.7(DAT0)
SDX_D1: J16.8(DAT1)
SDX_D2: J16.1(DAT2)
SDX_D3: J16.2(CD/DAT3)

Not connected (* = marked no-connect by the designer): J16 9(CD_SW1)* 10(CD_SW2)*

### Notes on the sheet
- (in symbol 104031-0811) uSD CARD
- (in symbol GRT188R6YA475KE13D) 0603 | 35V

### Library data of the parts
C24 = GRT188R6YA475KE13D: as C5 on sheet RP_ComputeModule3_rev.3.0_POWER; Supplier 1: Mouser; Manufacturer Part Number: GRT188R6YA475KE13D; Stock 1: 292; Pricing 1: 10000=0.133 (USD); Mount: Surface Mount; Case/Package: 0603; Case Code (Metric): 1608; Case Code (Imperial): 0603; Min Operating Temperature: -55°C; Max Operating Temperature: 85°C; Packaging: Tape and Reel; Voltage Rating: 35V; Length: 0.063inch; Width: 0.031inch; Thickness: 0.035inch; ComponentLink1URL: http://search.murata.co.jp/Ceramy/image/img/A01X/G101/ENG/GRT188R6YA475KE13-01.pdf; ComponentLink1Description: http://search.murata.co.jp/Ceramy/image/img/A01X/G101/ENG/GRT188R6YA475KE13-01.pdf
J16 = 104031-0811: CONN MICRO SD CARD PUSH-PULL R/A; Manufacturer: Molex; Number of Contacts: 8; Current Rating: 500mA; Voltage Rating (AC): 10V; Mating Cycles: 10000; Connector Type: Connector; Gender: Female; Pitch: 1.1mm; Supplier 1: Mouser; Manufacturer Part Number: 104031-0811; Stock 1: 13417; Pricing 1: 1=1.75, 10=1.59, 50=1.59, 100=1.36, 1000=0.97, 10000=0.86 (USD); Mount: Surface Mount,Standard; Contact Material: Bronze; Contact Plating: Nickel,Gold; Housing Material: Polymer; Min Operating Temperature: -25°C; Max Operating Temperature: 85°C; Number of Rows: 1; Orientation: Right Angle; Packaging: Tape and Reel; Package Quantity: 1; Termination: Solder; Number of Circuits: 8; Length: 11.14mm; Height: 1.42mm; Width: 11.4mm; Depth: 11.4mm; Radiation Hardening: No; REACH SVHC: Unknown; Halogen Free: Low Halogen; ComponentLink1URL: https://datasheet.ciiva.com/4581/1040310811-memory-card-socket-153593-4581012.pdf; ComponentLink1Description: https://datasheet.ciiva.com/4581/1040310811-memory-card-socket-153593-4581012.pdf; ComponentLink2URL: https://datasheet.ciiva.com/683/1040310811-sd-683579.pdf; ComponentLink2Description: https://datasheet.ciiva.com/683/1040310811-sd-683579.pdf; ComponentLink3URL: https://datasheet.ciiva.com/16655/1040310811-memory-card-socket-16655292.pdf; ComponentLink3Description: https://datasheet.ciiva.com/16655/1040310811-memory-card-socket-16655292.pdf; ComponentLink4URL: https://datasheet.ciiva.com/15174/getdatasheetpartid-716154-15174887.pdf; ComponentLink4Description: https://datasheet.ciiva.com/15174/getdatasheetpartid-716154-15174887.pdf; ComponentLink5URL: https://datasheet.ciiva.com/683/1040310811-sd-683580.pdf; ComponentLink5Description: https://datasheet.ciiva.com/683/1040310811-sd-683580.pdf; ComponentLink6URL: https://datasheet.ciiva.com/683/1040310811-sd-683581.pdf; ComponentLink6Description: https://datasheet.ciiva.com/683/1040310811-sd-683581.pdf; ComponentLink7URL: https://datasheet.ciiva.com/3121/1040310811-memory-card-socket-3121437.pdf; ComponentLink7Description: https://datasheet.ciiva.com/3121/1040310811-memory-card-socket-3121437.pdf; ComponentLink8URL: https://datasheet.ciiva.com/16496/1040310811-memory-card-socket-16496702.pdf; ComponentLink8Description: https://datasheet.ciiva.com/16496/1040310811-memory-card-socket-16496702.pdf

## Sheet RP_ComputeModule3_rev.3.0_Headers.SchDoc
size A4 portrait
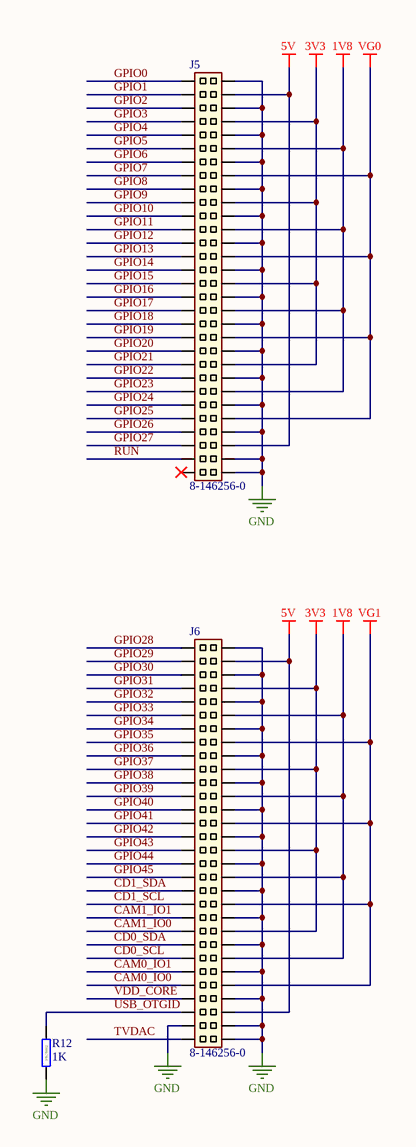
[diagram p4: RP_ComputeModule3_rev.3.0_Headers.SchDoc]

### Parts
J5  8-146256-0  [TE 2x30 PINS 8-146256-0]
J6  8-146256-0  [TE 2x30 PINS 8-146256-0]
R12  1K  [RES0402]

### Nets
1V8: J5.12 J5.24 J5.36 J5.48 J6.12 J6.24 J6.36 J6.48
3V3: J5.8 J5.20 J5.32 J5.44 J6.8 J6.20 J6.32 J6.44
5V: J5.4 J5.56 J6.4 J6.56
GND: J5.2 J5.6 J5.10 J5.14 J5.18 J5.22 J5.26 J5.30 J5.34 J5.38 J5.42 J5.46 J5.50 J5.54 J5.58 J5.60 J6.2 J6.6 J6.10 J6.14 J6.18 J6.22 J6.26 J6.30 J6.34 J6.38 J6.42 J6.46 J6.50 J6.54 J6.57 J6.58 J6.60 R12.2
VG0: J5.16 J5.28 J5.40 J5.52
VG1: J6.16 J6.28 J6.40 J6.52
CAM0_IO0: J6.51
CAM0_IO1: J6.49
CAM1_IO0: J6.43
CAM1_IO1: J6.41
CD0_SCL: J6.47
CD0_SDA: J6.45
CD1_SCL: J6.39
CD1_SDA: J6.37
GPIO0: J5.1
GPIO1: J5.3
GPIO2: J5.5
GPIO3: J5.7
GPIO4: J5.9
GPIO5: J5.11
GPIO6: J5.13
GPIO7: J5.15
GPIO8: J5.17
GPIO9: J5.19
GPIO10: J5.21
GPIO11: J5.23
GPIO12: J5.25
GPIO13: J5.27
GPIO14: J5.29
GPIO15: J5.31
GPIO16: J5.33
GPIO17: J5.35
GPIO18: J5.37
GPIO19: J5.39
GPIO20: J5.41
GPIO21: J5.43
GPIO22: J5.45
GPIO23: J5.47
GPIO24: J5.49
GPIO25: J5.51
GPIO26: J5.53
GPIO27: J5.55
GPIO28: J6.1
GPIO29: J6.3
GPIO30: J6.5
GPIO31: J6.7
GPIO32: J6.9
GPIO33: J6.11
GPIO34: J6.13
GPIO35: J6.15
GPIO36: J6.17
GPIO37: J6.19
GPIO38: J6.21
GPIO39: J6.23
GPIO40: J6.25
GPIO41: J6.27
GPIO42: J6.29
GPIO43: J6.31
GPIO44: J6.33
GPIO45: J6.35
RUN: J5.57
TVDAC: J6.59
USB_OTGID: J6.55 R12.1
VDD_CORE: J6.53

Not connected (* = marked no-connect by the designer): J5 59*

### Notes on the sheet
- (in symbol RK73H1FTTBL1001F) 1% | 0402

### Library data of the parts
J5 J6 = 8-146256-0: Headers & Wire Housings 60 MODII HDR DRST B/A .100CL LF; Manufacturer: TE Connectivity; Number of Positions: 60; Insulation Resistance: 5GR; Connector Type: Plug,Pin,Header; Board Standoff: Yes (With); Contact Protection: No (Without); High Speed Serial Data Connector: No; High Temperature Housing: Yes; PCB Mount Retention: Without; PCB Mounting Orientation: Vertical; Contact Current Rating: 3A; Pitch: 2.54mm; Mating Post Length: 0.23inch; PCB Thickness: 0.062inch; Approvals: CSA; Supplier 1: Mouser; Manufacturer Part Number: 8-146256-0; Stock 1: 114; Pricing 1: 1=7.66, 10=7.66, 50=6.28, 100=5.82, 1000=4.97, 10000=4.97 (USD); Mount: Through Hole; Contact Material: Bronze; Contact Plating: Nickel,Tin,Gold,Matte; Colour: Black; Housing Colour: Black; Housing Material: Thermoplastic; Contact Shape: Square; Min Operating Temperature: -65°C; Max Operating Temperature: 105°C; Contact Gender: Male; Package Quantity: 50; Number of Rows: 2; Packaging: Carton; Termination: Through Hole; Number of Contacts: 60; Orientation: Straight; Gasket: No (Without); Keyed: No; Mating Alignment: No (Without); Mating Connector Lock: No (Without); Selectively Loaded: No (Without); Stabilizers: No (Without); Strain Relief: No (Without); Length: 75.79mm; Row Spacing: 2.54mm; Termination Post Length: 0.12inch; Contact Mating Length: 0.23inch; Depth: 4.88mm; Radiation Hardening: No; ELV: Compliant; Flammability Rating: UL94 V-0; ComponentLink1URL: https://datasheet.ciiva.com/734/eng-cd-146256-g-146256-c-dwg-734694.pdf; ComponentLink1Description: https://datasheet.ciiva.com/734/eng-cd-146256-g-146256-c-dwg-734694.pdf; ComponentLink2URL: https://datasheet.ciiva.com/9491/eng-ds-1307819-ampmodu-0811-9491229.pdf; ComponentLink2Description: https://datasheet.ciiva.com/9491/eng-ds-1307819-ampmodu-0811-9491229.pdf
R12 = RK73H1FTTBL1001F: Thick Film Resistors - SMD 1/3W 1K OHM 1%; Manufacturer: KOA Speer; Power Rating: 30 mW; Resistance: 1 kOhms; Temperature Coefficient: 250 PPM / C; Voltage Rating: 15 V; Qualification: AEC-Q200; Supplier 1: Mouser; Manufacturer Part Number: RK73H1FTTBL1001F; RoHS: RoHS Compliant By Exemption; Category: Thick Film Resistors - SMD; Stock 1: 6349; Pricing 1: 1=0.641, 10=0.346, 100=0.196, 1000=0.130, 20000=0.123, 40000=0.101 (USD); Height: 0.13 mm; Length: 0.4 mm; Operating Temperature Range: - 55 C to + 125 C; Package / Case: 01005 (0402 metric); Packaging: Cut Tape; Product: Thick Film Resistors SMD; Series: RK73H; Termination Style: SMD/SMT; Tolerance: 1 %; Type: Precision Resistor; Width: 0.2 mm; Brand: KOA Speer; Case Code - in: 01005; Case Code - mm: 0402; Maximum Operating Temperature: + 125 C; Minimum Operating Temperature: - 55 C; Standard Pack Qty: 20000; RoHS - Mouser: E; Minimum Order Quantity: 1; Reeling: True; ComponentLink1URL: http://www.mouser.com/ds/2/219/RK73H-5715.pdf; ComponentLink1Description: http://www.mouser.com/ds/2/219/RK73H-5715.pdf